# EAGLE design emonVS (EAGLE 9.6.2)
AUTHOR: OpenEnergyMonitor; IGNORE_RENUMBER: F;RV; SOURCE: github.com/openenergymonitor/emonVoltageSense; VERSION: 1.3.1
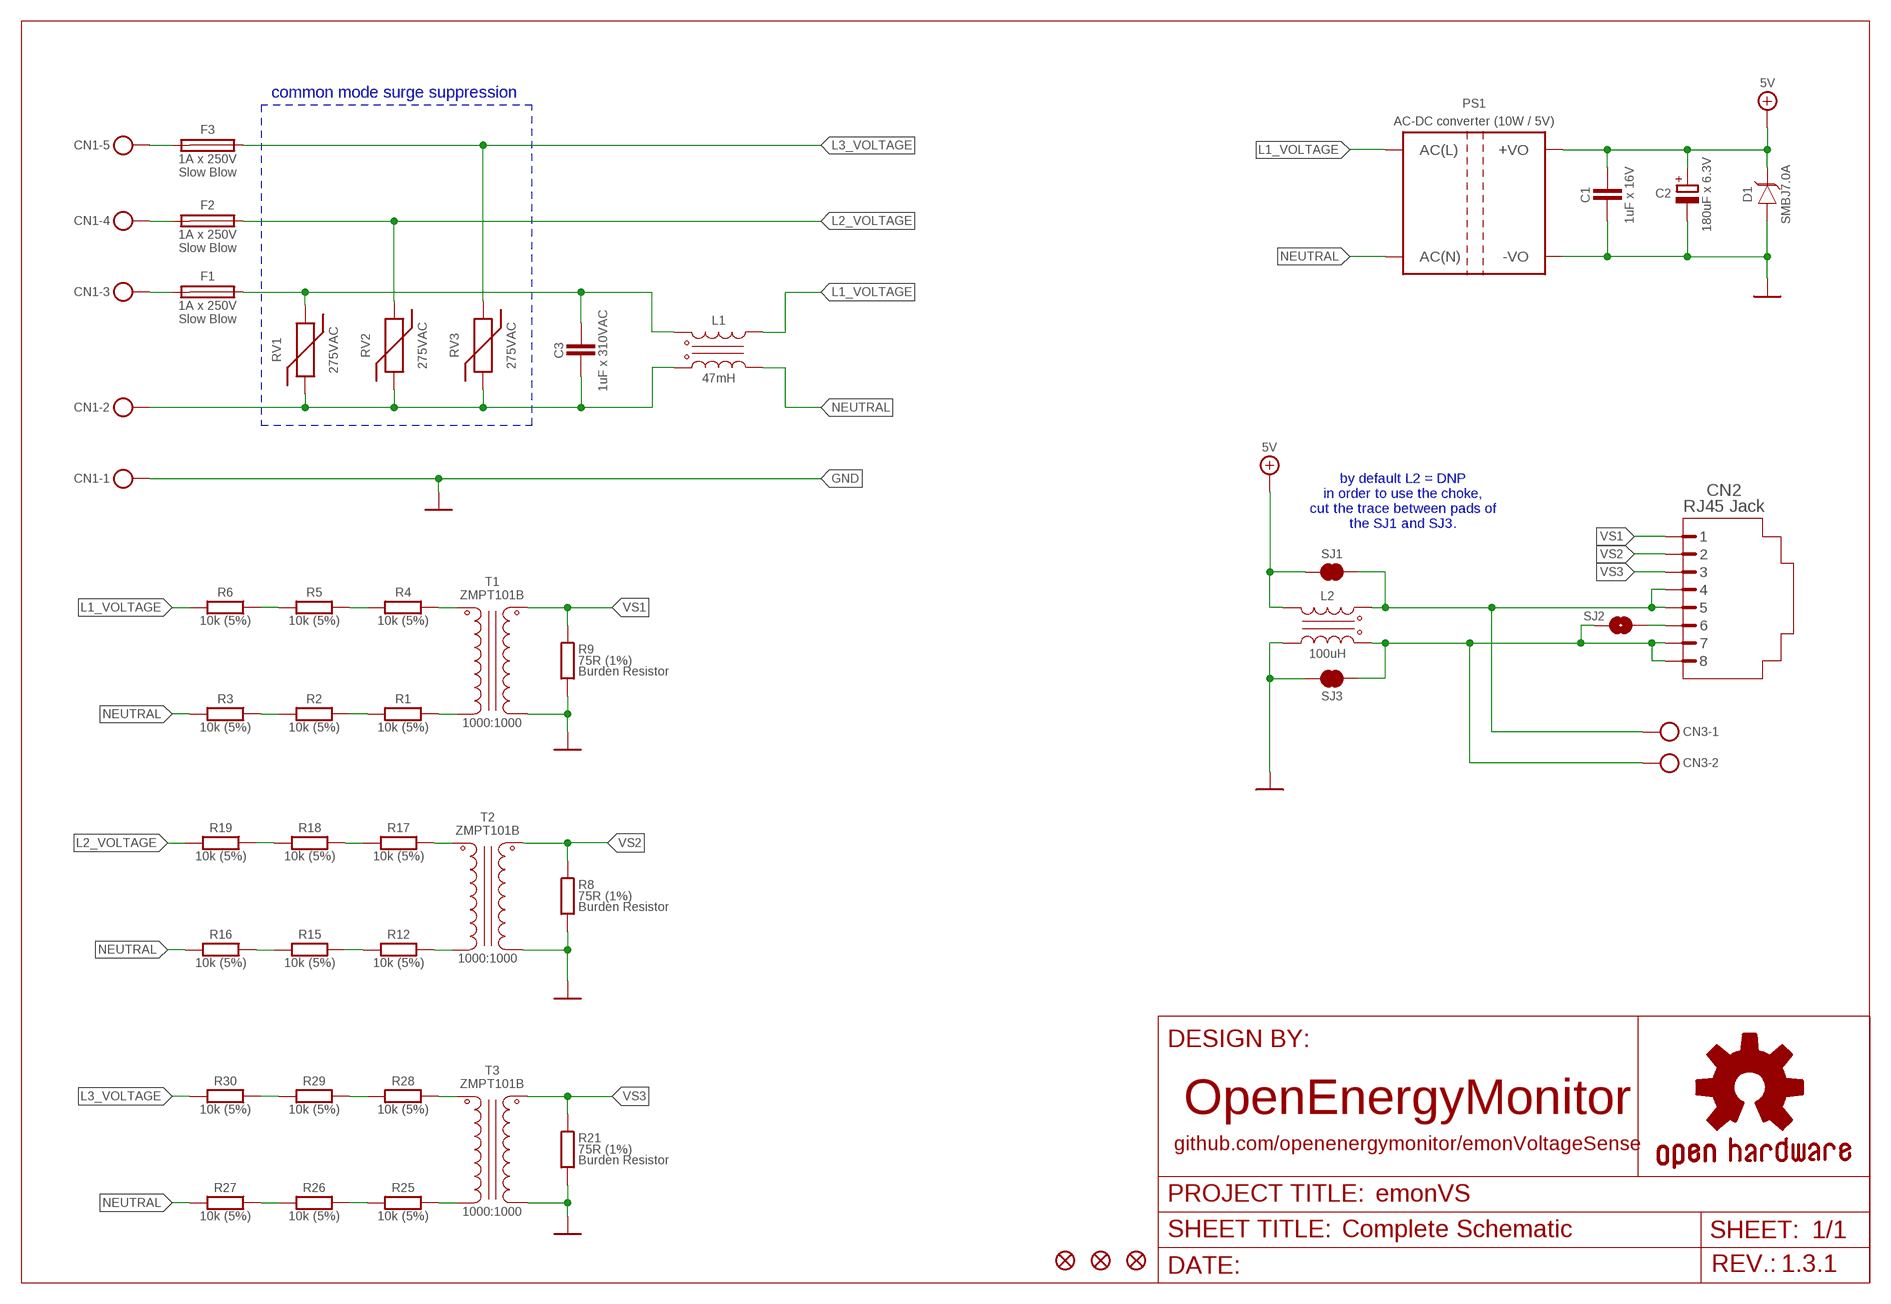
[diagram p0: schematic, sheet 1]

## Parts
C1  1uF x 16V  C_0603  [C0603]
C2  180uF x 6.3V  CP_SV-C  [CSV-C]
C3  1uF x 310VAC  C_  [C_PTH]
CN1  TERMINAL_BLOCK_5P  [TERMINAL_BLOCK_5P]
CN2  RJ45 Jack  RJ45-8PPTH  [RJ45-8P]
CN3  TERMINAL_BLOCK_2P  [TERMINAL_BLOCK_2P]
D1  TVS  [DO-214AA]
F1  1A x 250V  FUSE  [FUSE]
F2  1A x 250V  FUSE  [FUSE]
F3  1A x 250V  FUSE  [FUSE]
FD1  FIDUCIAL1X2  [FIDUCIAL]
FD2  FIDUCIAL1X2  [FIDUCIAL]
FD3  FIDUCIAL1X2  [FIDUCIAL]
L1  47mH  CHOKES-SCHAFFNER-RN214+RN212  [CHOKE_SCHAFFNER]
L2  100uH  CHOKES-WE-SL3  [CHOKE_WURTH]
PS1  AC-DC converter (10W / 5V)  MULTICOMP-AC/DC  [MULTICOMP-AC/DC]
R1  10k (5%)  R_0603  [R0603]
R2  10k (5%)  R_0603  [R0603]
R3  10k (5%)  R_0603  [R0603]
R4  10k (5%)  R_0603  [R0603]
R5  10k (5%)  R_0603  [R0603]
R6  10k (5%)  R_0603  [R0603]
R8  75R (1%)  R_  [R_PTH_SMD]
R9  75R (1%)  R_  [R_PTH_SMD]
R12  10k (5%)  R_0603  [R0603]
R15  10k (5%)  R_0603  [R0603]
R16  10k (5%)  R_0603  [R0603]
R17  10k (5%)  R_0603  [R0603]
R18  10k (5%)  R_0603  [R0603]
R19  10k (5%)  R_0603  [R0603]
R21  75R (1%)  R_  [R_PTH_SMD]
R25  10k (5%)  R_0603  [R0603]
R26  10k (5%)  R_0603  [R0603]
R27  10k (5%)  R_0603  [R0603]
R28  10k (5%)  R_0603  [R0603]
R29  10k (5%)  R_0603  [R0603]
R30  10k (5%)  R_0603  [R0603]
RV1  275VAC  MOV_14MM_275VAC  [MOV]
RV2  275VAC  MOV_14MM_275VAC  [MOV]
RV3  275VAC  MOV_14MM_275VAC  [MOV]
SJ1  SOLDER_JUMPER_2P_NC  [SJ_2S-NC]
SJ2  SOLDER_JUMPER_2P_NO  [SJ_2S-NO]
SJ3  SOLDER_JUMPER_2P_NC  [SJ_2S-NC]
T1  ZMPT101B  [ZMPT101B]
T2  ZMPT101B  [ZMPT101B]
T3  ZMPT101B  [ZMPT101B]

## Nets
5.0V: C1.1 C2.+ D1.1(K) L2.6 PS1.+VO PS1.+VO_2(+VO) SJ1.1 ; supply symbol labelled 5V
5VF: CN2.4 CN2.5 CN3.2 L2.1 SJ1.2
GND: C1.2 C2.- CN1.1 D1.2(A) L2.4 PS1.-VO PS1.-VO_2(-VO) R8.1A R8.1B R9.1A R9.1B R21.1A R21.1B SJ3.1 T1.4(SEC_1) T2.4(SEC_1) T3.4(SEC_1) ; supply symbol labelled 0V
GNDF: CN2.7 CN2.8 CN3.1 L2.3 SJ2.1 SJ3.2
L1_VOLTAGE: L1.4A L1.4B PS1.AC(L) PS1.AC(L)_2(AC(L)) R6.2
L2_VOLTAGE: F2.OUT R19.2 RV2.1
L3_VOLTAGE: F3.OUT R30.2 RV3.1
N$1: R4.1 T1.2(PRI_1)
N$2: R1.1 T1.1(PRI_2)
N$3: R1.2 R2.1
N$4: R4.2 R5.1
N$5: R5.2 R6.1
N$6: R2.2 R3.1
N$7: CN1.3 F1.IN
N$8: CN1.4 F2.IN
N$9: CN2.6 SJ2.2
N$10: R17.1 T2.2(PRI_1)
N$11: R12.1 T2.1(PRI_2)
N$12: R12.2 R15.1
N$13: R17.2 R18.1
N$14: R18.2 R19.1
N$15: R15.2 R16.1
N$16: CN1.5 F3.IN
N$18: R28.1 T3.2(PRI_1)
N$19: R25.1 T3.1(PRI_2)
N$21: R25.2 R26.1
N$22: R28.2 R29.1
N$23: R29.2 R30.1
N$24: R26.2 R27.1
N$28: C3.1A C3.1B CN1.2 L1.1A L1.1B RV1.2 RV2.2 RV3.2
N$29: C3.2A C3.2B F1.OUT L1.2A L1.2B RV1.1
NEUTRAL: L1.3A L1.3B PS1.AC(N) PS1.AC(N)_2(AC(N)) R3.2 R16.2 R27.2
VS1: CN2.1 R9.2A R9.2B T1.3(SEC_2)
VS2: CN2.2 R8.2A R8.2B T2.3(SEC_2)
VS3: CN2.3 R21.2A R21.2B T3.3(SEC_2)

## Notes on the sheet
- common mode surge suppression
- by default L2 = DNP
  in order to use the choke,
  cut the trace between pads of
  the SJ1 and SJ3.

## Library data of the parts
C1 = My-RLC:C_: NON-POLARIZED CAP; PN: GCM188R71C105KA64D
C2 = My-RLC:CP_: POLARIZED CAP; PN: 6SVPE180M
C3 = OpenEnergyMonitor:C_: NON-POLARIZED CAP; PN: B32923C3105M000; PN1: B32923C3105M; PN2: DE2F3KY103MA3BM02F
CN1 = OpenEnergyMonitor:TERMINAL_BLOCK_5P: TE Connectivity - Fixed Terminal Blocks Number of Positions: 5 Position Pitch: 5 mm Connection Method: Screw Clamp Current Rating: 13.5 A Voltage Rating: 300 V Wire Gauge Min: 30 AWG Wire Gauge Max: 16 AWG; PN: 282836-5
CN2 = OpenEnergyMonitor:RJ45-8P: RJ45 Jack Simple RJ45, 8-pin connection - connector for common Cat5, Cat5e, and Cat6 Ethernet cables. Footprint not yet proven in production. Connector sku is PRT-00643; Breakout PCB sku is BOB-00716.; PN: PRT-00643
CN3 = OpenEnergyMonitor:TERMINAL_BLOCK_2P: TE Connectivity - Fixed Terminal Blocks Number of Positions: 2 Position Pitch: 5 mm Connection Method: Screw Clamp Current Rating: 13.5 A Voltage Rating: 300 V Wire Gauge Min: 30 AWG Wire Gauge Max: 16 AWG; PN: 282836-2
D1 = My-Diodes:TVS; FAMILY: SMBJ7.0A; PN: SMBJ7.0A
F1-F3 = OpenEnergyMonitor:FUSE; FAMILY: Slow Blow; PN: MST 1A 250V
FD1-FD3 = OpenEnergyMonitor:FIDUCIAL: Fiducial Alignment Points Point-of-reference for pick-and-place machines and other optical instruments.
L1 = OpenEnergyMonitor:CHOKES: Schaffner Common Mode Chokes RN series Current-compensated Chokes; PN: RN214-0.3-02-47M
L2 = OpenEnergyMonitor:CHOKES: Schaffner Common Mode Chokes RN series Current-compensated Chokes; PN: 744252101
PS1 = OpenEnergyMonitor:MULTICOMP-AC/DC: Multicomp PRO - AC to DC Converter Module This device supports 5W module (MP-LD05-23B05R2) (square footprint) and 10W module (MP-LD10-23B05R2) (rectangle footprint).; PN: MP-LD10-23B05R2
R1-R6 R12 R15-R19 R25-R30 = My-RLC:R_: RESISTOR; PN: ERJ-H3GJ103V
R8 R9 R21 = OpenEnergyMonitor:R_: Burden Resistors This footprint supports SMD 0603 package and PTH 0204 package.; DESCRIPTION: Burden Resistor; PN: ERJ-H3EF75R0V
RV1-RV3 = OpenEnergyMonitor:MOV_: MOV - Metal-Oxide Varistor; PN: MOV-14D431KTR
SJ1 SJ3 = OpenEnergyMonitor:SOLDER_JUMPER_2P_NC: Solder Jumper Standard SMD solder jumper. Used to automate production. Two varients : Normally Open and Normally Closed are the same, but have different paste layers. NC will have a large amount of paste and should jumper during reflow.
SJ2 = OpenEnergyMonitor:SOLDER_JUMPER_2P_NO: Solder Jumper Standard SMD solder jumper. Used to automate production. Two varients : Normally Open and Normally Closed are the same, but have different paste layers. NC will have a large amount of paste and should jumper during reflow.
T1-T3 = OpenEnergyMonitor:ZMPT101B: Current-type Voltage Transformer Source: Datasheet; PN: ZMPT101B; RATIO: 1000:1000

## Net classes
0 default: clearance 0.205 mm
1 power: width 0.305 mm, drill 0.6 mm, clearance 0.254 mm
2 gnd: width 0.254 mm, drill 0.6 mm, clearance 0.254 mm

## Board
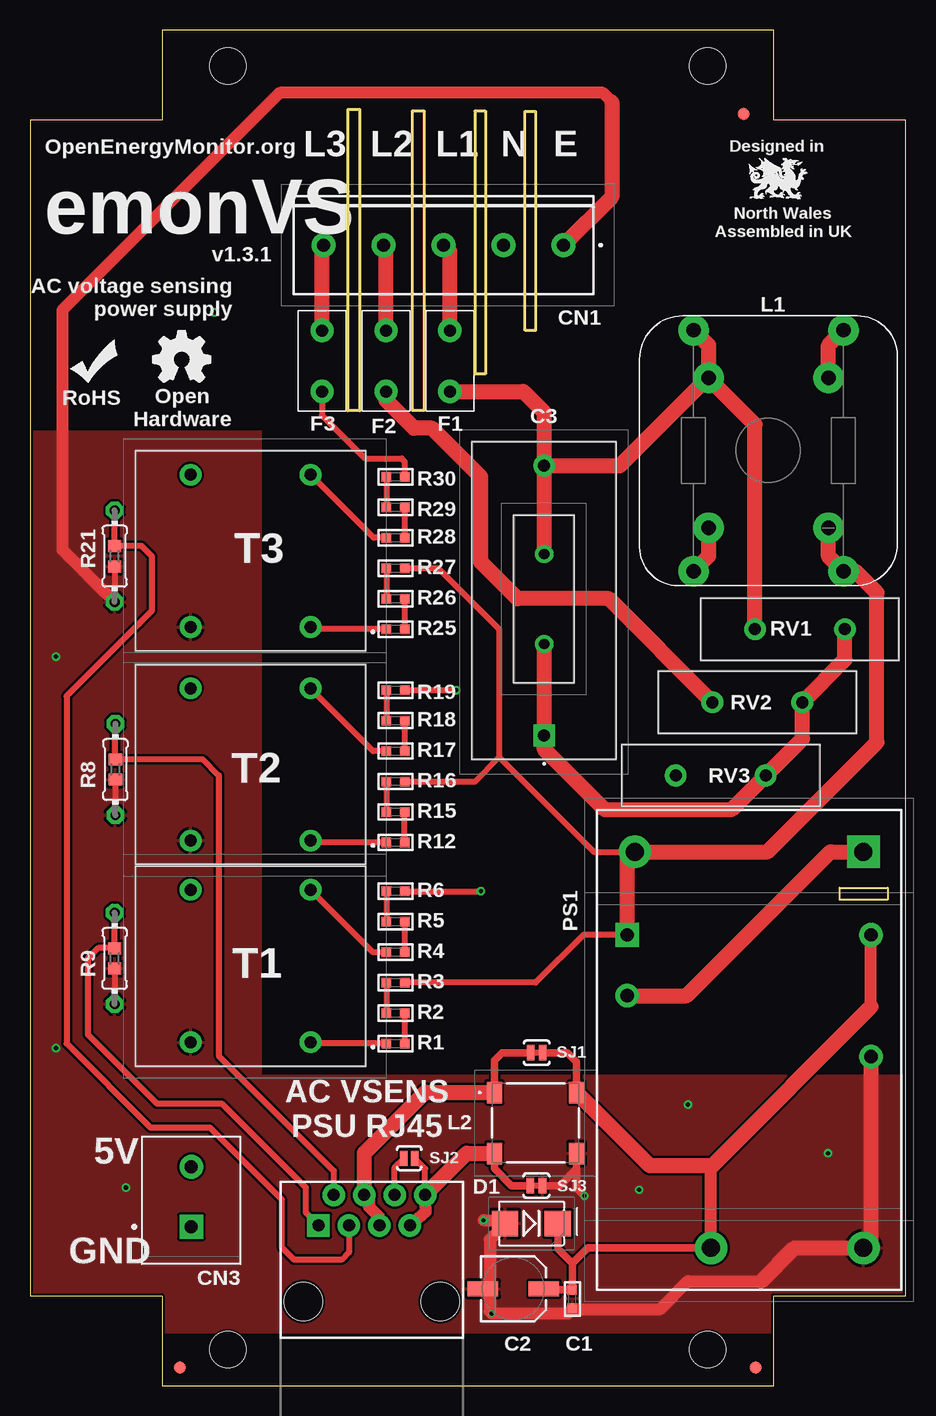
[diagram p1: board, top side]
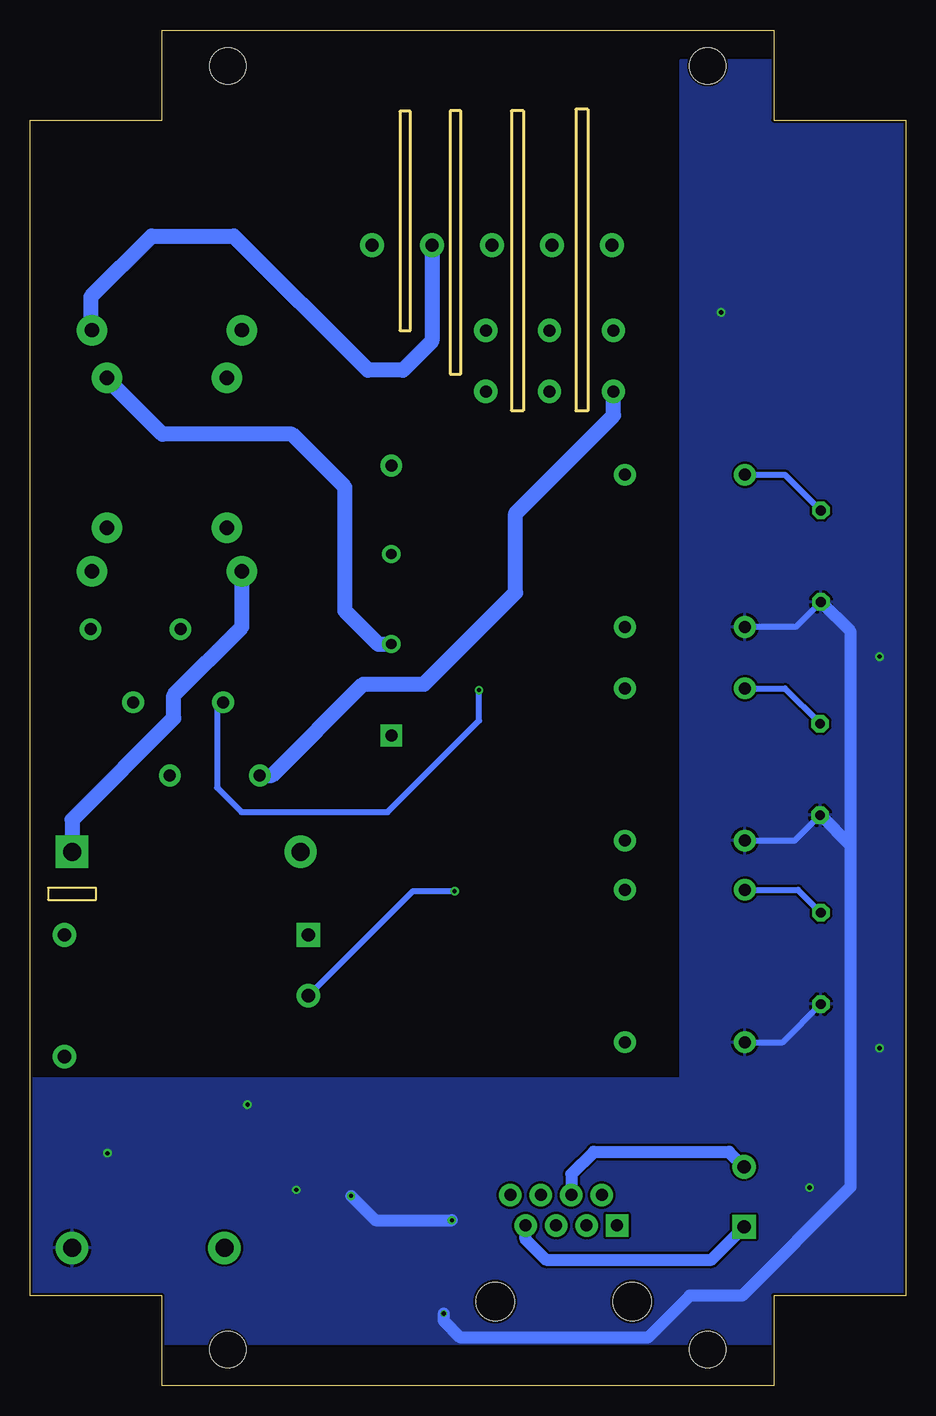
[diagram p2: board, bottom side, seen from below]

Size 73 x 113 mm. Coordinates in mm from the lower left corner, seen from the top.
Outline: 0,7.5 11,7.5 11,0 62,0 62,7.5 73,7.5 73,105.5 62,105.5 62,113 11,113 11,105.5 0,105.5 0,7.5
Copper layers (1*16): Top 0.035mm / dielectric 1.6mm / Bottom 0.035mm
Design rules "jlcpcb-2layers *": minimum track width 5mil, minimum drill 0.3mm, track to track 5mil, track to pad 5mil, pad to pad 5mil, via to via 5mil, smd to smd 5mil, copper to edge 0.2mm, drill to drill 6mil, minimum pad ring 10mil, minimum via ring 3mil, stop-mask expansion 4mil, vias tented up to drill 14mil, thermal gap 10mil
Holes 3 mm at 16.5,3 16.5,110 56.5,3 56.5,110
tKeepout: area 13.5,0 to 19.5,6; area 53.5,0 to 59.5,6; area 53.5,107 to 59.5,113; area 13.5,107 to 19.5,113; area 25,108.5 to 48.5,113; area 25,0 to 48.5,4.5
Milling: 20 lines

### Footprints (pad centres in the part's own frame; a part is rotated, then mirrored left to right if it is on the bottom)
C0603 = smd 0.8 x 0.8: 1 -0.762,0; 2 0.762,0
CSV-C = smd 2.54 x 1.27: + -2.54,0; - 2.54,0
C_PTH = drill 1 pad 1.5 square: 1A 0,0 | drill 0.85 pad 1.381: 1B 0,7.62; 2B 0,15.12 | drill 1 pad 1.5: 2A 0,22.5
TERMINAL_BLOCK_5P = drill 1.1 pad 1.65: 1 0,0; 2 5,0; 3 10,0; 4 15,0; 5 20,0
RJ45-8P = drill 1 pad 1.88 square: 1 -4.445,6.35 | drill 1 pad 1.88: 2 -3.175,8.89; 3 -1.905,6.35; 4 -0.635,8.89; 5 0.635,6.35; 6 1.905,8.89; 7 3.175,6.35; 8 4.445,8.89 | hole 3.2: -5.715,0; 5.715,0
TERMINAL_BLOCK_2P = drill 1.1 pad 1.6 square: 1 -2.5,0 | drill 1.1 pad 1.6: 2 2.5,0
DO-214AA = smd 2.2 x 2.15: 1 -2.2,0; 2 2.2,0
FUSE = drill 1 pad 1.93: IN 2,1.66; OUT 2,6.74
FIDUCIAL = smd 1 x 1: 1 0,0
CHOKE_SCHAFFNER = drill 1.2 pad 2.54: 1A -6.332,-9.976; 1B -5.07,-5.993; 2A 6.168,-9.976; 2B 4.93,-5.993; 3A -6.332,10.124; 3B -5.07,6.507; 4A 6.168,10.124; 4B 4.93,6.507
CHOKE_WURTH = smd 1.78 x 1.27: 1 -2.54,-3.43; 3 2.54,-3.43; 4 2.54,3.43; 6 -2.54,3.43
MULTICOMP-AC/DC = drill 1.5 pad 2.25: +VO -5.72,-17.526; -VO 6.985,-17.526; AC(N) -12.065,15.494 | drill 1.1 pad 1.65: +VO_2 7.62,8.572; -VO_2 7.62,-1.587; AC(L)_2 -12.7,3.493 | drill 1.5 pad 2.25 square: AC(L) 6.985,15.494 | drill 1.1 pad 1.65 square: AC(N)_2 -12.7,8.572
R0603 = smd 0.8 x 0.8: 1 -0.762,0; 2 0.762,0
R_PTH_SMD = drill 0.813 octagon: 1A -3.81,0; 2A 3.81,0 | smd 1 x 1.1: 1B -0.85,0; 2B 0.85,0
MOV = drill 1 pad 1.5: 1 0,0; 2 7.5,0
SJ_2S-NC = smd 0.635 x 1.27: 1 -0.508,0; 2 0.508,0
SJ_2S-NO = smd 0.635 x 1.27: 1 -0.45,0; 2 0.45,0
ZMPT101B = drill 1 pad 1.5: 1 0,0; 2 0,-12.7; 3 10,-12.7; 4 10,0

### Placement (x,y rotation side)
C1  45.22,7.22 270 top
C2  40.3,8.06 180 top
C3  42.87,54.19 0 top
CN1  44.49,95.07 180 top
CN2  28.5,7 0 top
CN3  13.45,15.74 90 top
D1  41.81,13.5 180 top
F1  37,89.61 180 top
F2  31.67,89.61 180 top
F3  26.35,89.61 180 top
FD1  12.5,1.5 0 top
FD2  60.5,1.5 0 top
FD3  59.5,106 0 top
L1  61.5,78 180 top
L2  42.15,21.89 270 top
PS1  62.5,29 0 top
R1  30.48,28.5 0 top
R2  30.48,31.04 180 top
R3  30.48,33.58 0 top
R4  30.48,36.12 0 top
R5  30.48,38.66 180 top
R6  30.48,41.2 0 top
R8  7.12,51.35 90 top
R9  7.06,35.6 90 top
R12  30.48,45.27 0 top
R15  30.48,47.81 180 top
R16  30.48,50.35 0 top
R17  30.48,52.89 0 top
R18  30.48,55.43 180 top
R19  30.48,57.97 0 top
R21  7.06,69.13 90 top
R25  30.48,63.05 0 top
R26  30.48,65.59 180 top
R27  30.48,68.13 0 top
R28  30.48,70.67 0 top
R29  30.48,73.21 180 top
R30  30.48,75.75 0 top
RV1  60.45,63.05 0 top
RV2  56.9,56.95 0 top
RV3  53.85,50.86 0 top
SJ1  42.25,27.74 180 top
SJ2  31.62,18.95 180 top
SJ3  42.22,16.67 180 top
T1  23.39,28.62 180 top
T2  23.39,45.42 180 top
T3  23.39,63.23 180 top

### Tracks (layer width: path | path; a pad name or v marks a point on that pad's centre or on a via)
5.0V
  Top 0.61: SJ1.1 44.81,27.74 45.58,26.97 L2.6 | C2.+ 42.92,7.98 C1.1 45.22,10.18 | D1.1 44.01,11.39 45.22,10.18 | 45.22,10.18 46.52,11.48 PS1.+VO
  Top 1.016: PS1.+VO 56.78,18.23 56.8,18.24 | 70.12,31.57 PS1.+VO_2
  Top 1.27: 70.12,31.57 56.8,18.24 56.69,18.34 51.66,18.34 L2.6
5VF
  Top 0.61: SJ1.2 41.72,27.72 39.34,27.72 38.72,27.09 L2.1
  Top 1.016: CN2.4 28.26,15.49 28.26,14.91 29.14,14.04 CN2.5
  Top 1.27: CN2.4 27.86,19.36 32.94,24.44 38.71,24.44 L2.1
  Bottom 1.016: CN2.4 27.86,17.64 26,19.5 14.71,19.5 CN3.2
GND  (via drill 0.35, 0.35 pad 0.7)
  Top 0.508: 39.39,13.77 39.66,13.5 | R21.1B R21.1A | R8.1B R8.1A | R9.1B R9.1A
  Top 0.61: SJ3.1 44.17,16.67 45.58,18.08 | 45.58,18.08 L2.4 | v46.23,15.8 45.58,16.45 45.58,18.08
  Top 1.016: 60.96,8.69 54.86,8.69 52.54,6.37 45.22,6.37 44.85,6 v38.5,6 38.33,6.17 38.33,12.18 39.66,13.5 | v37.82,13.77 39.39,13.77 | 48.5,107 47.75,107.75 20.83,107.75 2.71,89.63 2.71,69.68 R21.1A | L2.4
  Top 1.27: PS1.-VO_2 70.12,12.11 PS1.-VO 63.74,11.47 60.96,8.69 | 48.5,107 48.5,99.08 CN1.1
  Bottom 0.508: T3.4 9.15,63.23 R21.1A | R8.1A 9.24,45.42 T2.4 | T1.4 10.23,28.62 R9.1A
  Bottom 1.016: v46.23,15.8 44.2,13.77 v37.82,13.77 | v38.5,6 38.5,5.41 37.09,4 21.5,4 18,7.5 13.62,7.5 4.57,16.55 4.57,44.99 | R21.1A 4.57,62.83 4.57,44.99 | R8.1A 4.57,44.99
  other vias: 50.8,16.31 54.86,23.42 66.55,19.36 8,16.5 2.16,28.12 2.16,60.76 15.37,89.46
  pour Top: -3,79.5 -3,4.5 77,4.5 77,25.79 19.23,25.79 19.23,79.5
  pour Bottom: -4,111.5 -4,3.5 78,3.5 78,25.59 18.72,25.59 18.72,110.5 6,110.5 5,111.5
GNDF
  Top 0.508: CN2.8 32.95,18.07 SJ2.1
  Top 0.61: SJ3.2 40.16,16.67 38.72,18.11 L2.3
  Top 1.016: CN2.7 33.02,14.5 CN2.8
  Top 1.27: CN2.8 36.41,19.36 38.71,19.36 L2.3
  Bottom 1.016: CN2.7 31.68,12.18 30,10.5 16.17,10.5 13.45,13.22 CN3.1
L1_VOLTAGE  (via drill 0.35 pad 0.7)
  Top 0.508: R6.2 v37.59,41.2
  Top 1.27: L1.4B 56.57,69.11 L1.4A | PS1.AC(L)_2 54.74,32.49 66.74,44.49 PS1.AC(L)
  Bottom 0.508: PS1.AC(L)_2 41.09,41.2 v37.59,41.2
  Bottom 1.27: L1.4A 55.33,63.24 61.01,57.56 61.01,55.63 69.48,47.16 PS1.AC(L)
L2_VOLTAGE  (via drill 0.35 pad 0.7)
  Top 0.508: R19.2 v35.56,57.97
  Top 1.27: RV2.1 48.26,65.59 40.64,65.59 37.59,68.64 37.59,75.75 33.53,79.81 32,79.81 29.67,82.14 F2.OUT
  Bottom 0.508: RV2.1 57.4,56.44 57.4,49.84 55.37,47.81 43.18,47.81 35.56,55.43 v35.56,57.97
L3_VOLTAGE
  Top 0.508: F3.OUT 24.35,80.86 27.94,77.27 30.99,77.27 31.24,77.02 R30.2
  Bottom 1.27: RV3.1 52.83,50.86 45.21,58.48 40.13,58.48 32.51,66.1 32.51,72.7 24.35,80.86 F3.OUT
N$1
  Top 0.508: R4.1 28.59,36.12 T1.2
N$2
  Top 0.508: R1.1 23.51,28.5 T1.1
N$3
  Top 0.508: R2.1 R1.2
N$4
  Top 0.508: R5.1 R4.2
N$5
  Top 0.508: R6.1 R5.2
N$6
  Top 0.508: R3.1 R2.2
N$7
  Top 1.27: F1.IN 35,94.55 CN1.3
N$8
  Top 1.27: F2.IN 29.67,94.88 CN1.4
N$9
  Top 0.508: CN2.6 30.41,18.18 SJ2.2
N$10
  Top 0.508: R17.1 28.62,52.89 T2.2
N$11
  Top 0.508: R12.1 23.54,45.27 T2.1
N$12
  Top 0.508: R12.2 R15.1
N$13
  Top 0.508: R18.1 R17.2
N$14
  Top 0.508: R19.1 R18.2
N$15
  Top 0.508: R16.1 R15.2
N$16
  Top 1.27: F3.IN 24.35,94.93 CN1.5
N$18
  Top 0.508: R28.1 28.66,70.67 T3.2
N$19
  Top 0.508: R25.1 23.58,63.05 T3.1
N$21
  Top 0.508: R26.1 R25.2
N$22
  Top 0.508: R29.1 R28.2
N$23
  Top 0.508: R30.1 R29.2
N$24
  Top 0.508: R27.1 R26.2
N$28
  Top 1.27: C3.1B C3.1A 42.87,53.07 47.95,47.99 58.48,47.99 RV3.2 64.4,53.9 RV2.2 67.95,60.51 RV1.2 | L1.1A 66.57,86.71 L1.1B
  Bottom 1.27: CN1.2 39.49,87.06 41.91,84.64 44.83,84.64 56.01,95.81 62.87,95.81 67.92,90.76 67.92,88.06 L1.1A | C3.1B 43.97,61.81 46.74,64.57 46.74,74.88 51.16,79.3 61.98,79.3 66.57,83.9 L1.1B
N$29
  Top 1.27: F1.OUT 41.14,82.87 42.87,81.14 C3.2A | L1.2B 56.48,83.99 49.17,76.69 C3.2A | L1.2A 56.57,86.74 L1.2B | RV1.1 60.45,80.11 L1.2B | C3.2A C3.2B
NEUTRAL
  Top 0.508: 39.12,52.38 39.12,63.05 34.04,68.13 R27.2 | 39.12,52.38 37.08,50.35 R16.2 | PS1.AC(N) 47,44.49 39.12,52.38 | R3.2 42.16,33.58 46.15,37.57 PS1.AC(N)_2
  Top 1.27: L1.3B 66.57,69.14 L1.3A 68.82,67.88 70.61,66.09 70.61,53.62 61.48,44.49 PS1.AC(N) 49.8,43.86 PS1.AC(N)_2
VS1
  Top 0.508: CN2.1 23,14.41 23,16.5 16,23.5 10.59,23.5 4.83,29.27 4.83,35.62 5.68,36.47 7.05,36.47 R9.2B R9.2A
  Bottom 0.508: T1.3 8.97,41.32 R9.2A
VS2
  Top 0.508: CN2.2 25.32,17.91 15.75,27.49 15.75,50.86 14.39,52.21 7.13,52.21 R8.2B R8.2A
  Bottom 0.508: T2.3 10.06,58.12 7.12,55.19 R8.2A
VS3
  Top 0.508: CN2.3 26.59,11.1 26,10.5 22,10.5 21,11.5 21,15.5 15,21.5 10.05,21.5 3.05,28.5 3.05,57.46 9.11,63.52 10.16,64.57 10.16,69.14 9.31,69.99 7.07,69.99 R21.2B R21.2A
  Bottom 0.508: R21.2A 10.05,75.93 T3.3

### Text on the board
tPlace: OpenEnergyMonitor.org | Designed in | North Wales | emonVS | Assembled in UK | AC voltage sensing / power supply | RoHS | Open / Hardware
tNames: L3 | L2 | L1 | N | E | AC VSENS / PSU RJ45 | 5V | GND